# EAGLE schematic DAM1941 (EAGLE 9.3.1)

## Sheet 1 of 7
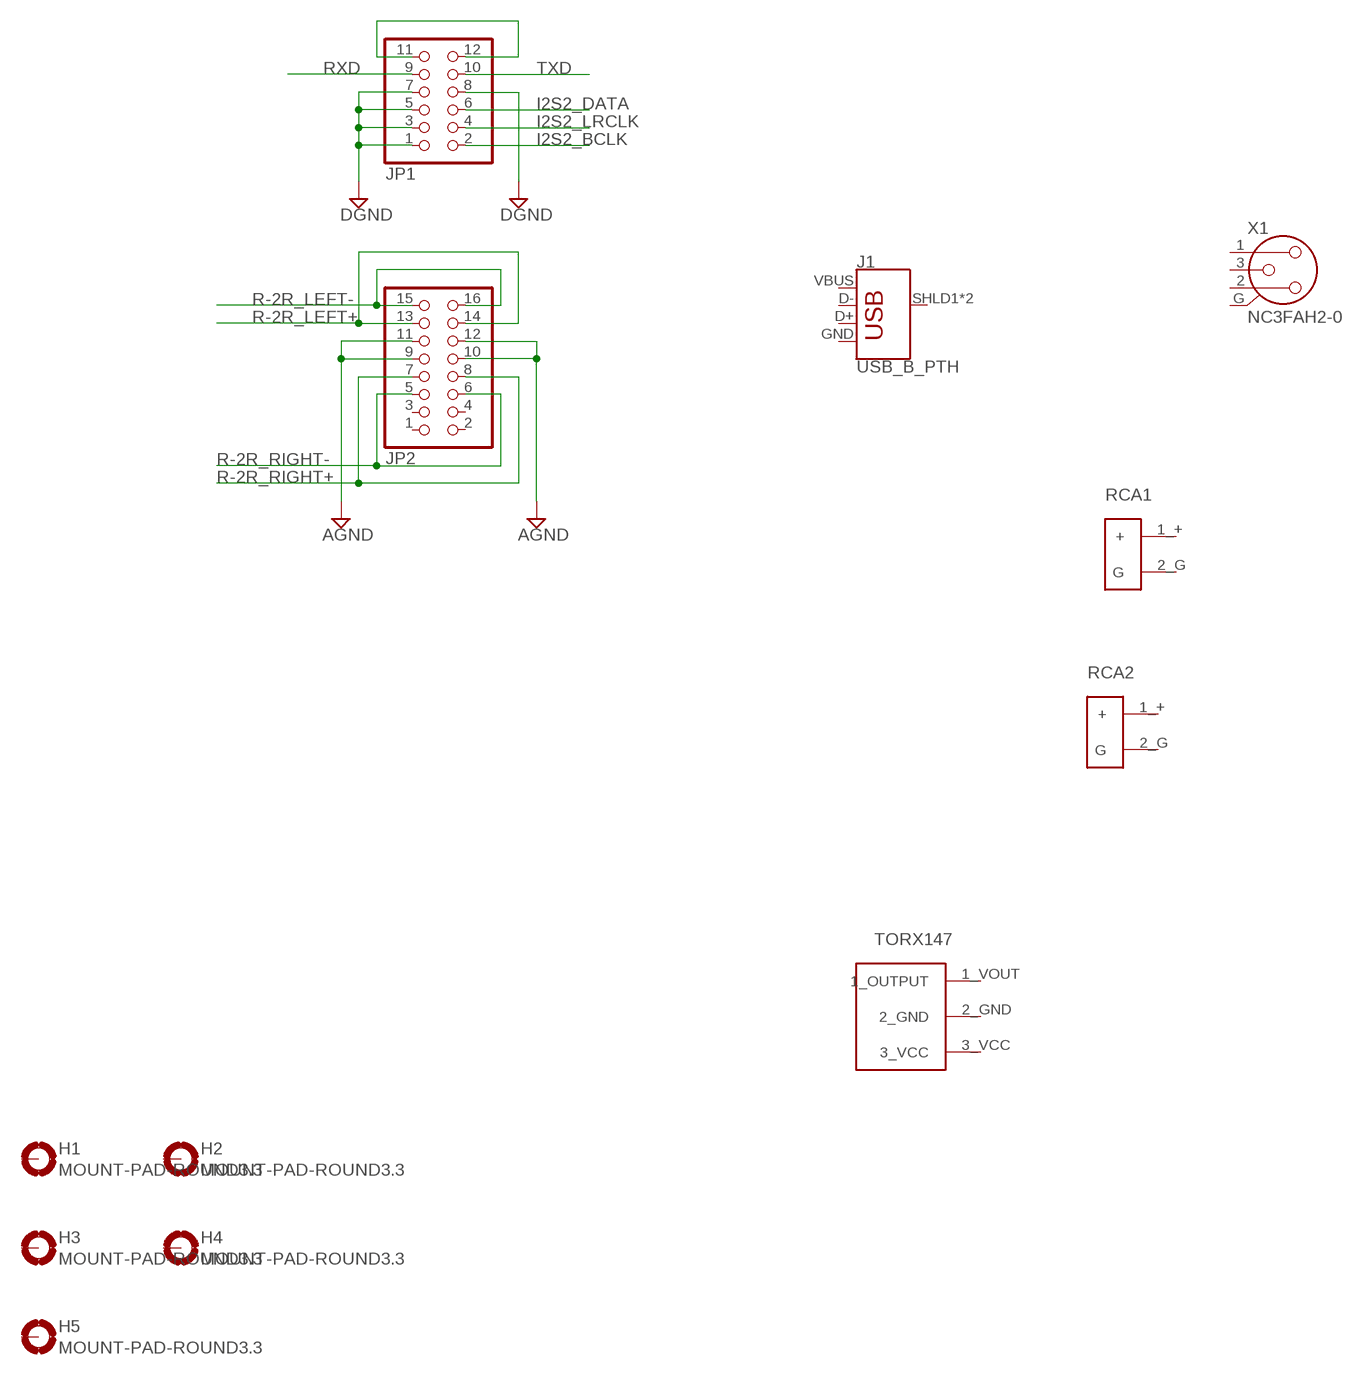
[diagram p0: schematic, sheet 1]

### Parts
H1  MOUNT-PAD-ROUND3.3  [3,3-PAD]
H2  MOUNT-PAD-ROUND3.3  [3,3-PAD]
H3  MOUNT-PAD-ROUND3.3  [3,3-PAD]
H4  MOUNT-PAD-ROUND3.3  [3,3-PAD]
H5  MOUNT-PAD-ROUND3.3  [3,3-PAD]
J1  USB_B_PTH  [USB-B-PTH]
JP1  PINHD-2X6/90  [2X06/90]
JP2  PINHD-2X8/90  [2X08/90]
RCA1  RCA  [RCA]
RCA2  RCA  [RCA]
U$1  TORX147  [TORX147]
X1  NC3FAH2-0  [NC3FAH2-0]

### Nets
AGND: JP2.9 JP2.10 JP2.11 JP2.12 ; also sheet 6
DGND: JP1.1 JP1.3 JP1.5 JP1.7 JP1.8 ; also sheet 3,5
I2S2_BCLK: JP1.2
I2S2_DATA: JP1.6
I2S2_LRCLK: JP1.4
N$1: JP1.11 JP1.12
R-2R_LEFT+: JP2.13 JP2.14 ; also sheet 2,3
R-2R_LEFT-: JP2.15 JP2.16 ; also sheet 2,3
R-2R_RIGHT+: JP2.7 JP2.8 ; also sheet 2,3
R-2R_RIGHT-: JP2.5 JP2.6 ; also sheet 2,3
RXD: JP1.9 ; also sheet 5
TXD: JP1.10 ; also sheet 5
Unconnected: H1.B3,3(MOUNT) H2.B3,3(MOUNT) H3.B3,3(MOUNT) H4.B3,3(MOUNT) H5.B3,3(MOUNT) J1.D+ J1.D- J1.SHLD1(SHIELD) J1.SHLD2(SHIELD) JP2.1 JP2.2 JP2.3 JP2.4 RCA1.1_+(+) RCA1.2_G(G) RCA2.1_+(+) RCA2.2_G(G) U$1.1_VOUT(1_OUTPUT) U$1.2_GND U$1.3_VCC X1.1 X1.2 X1.3 X1.G

## Sheet 2 of 7
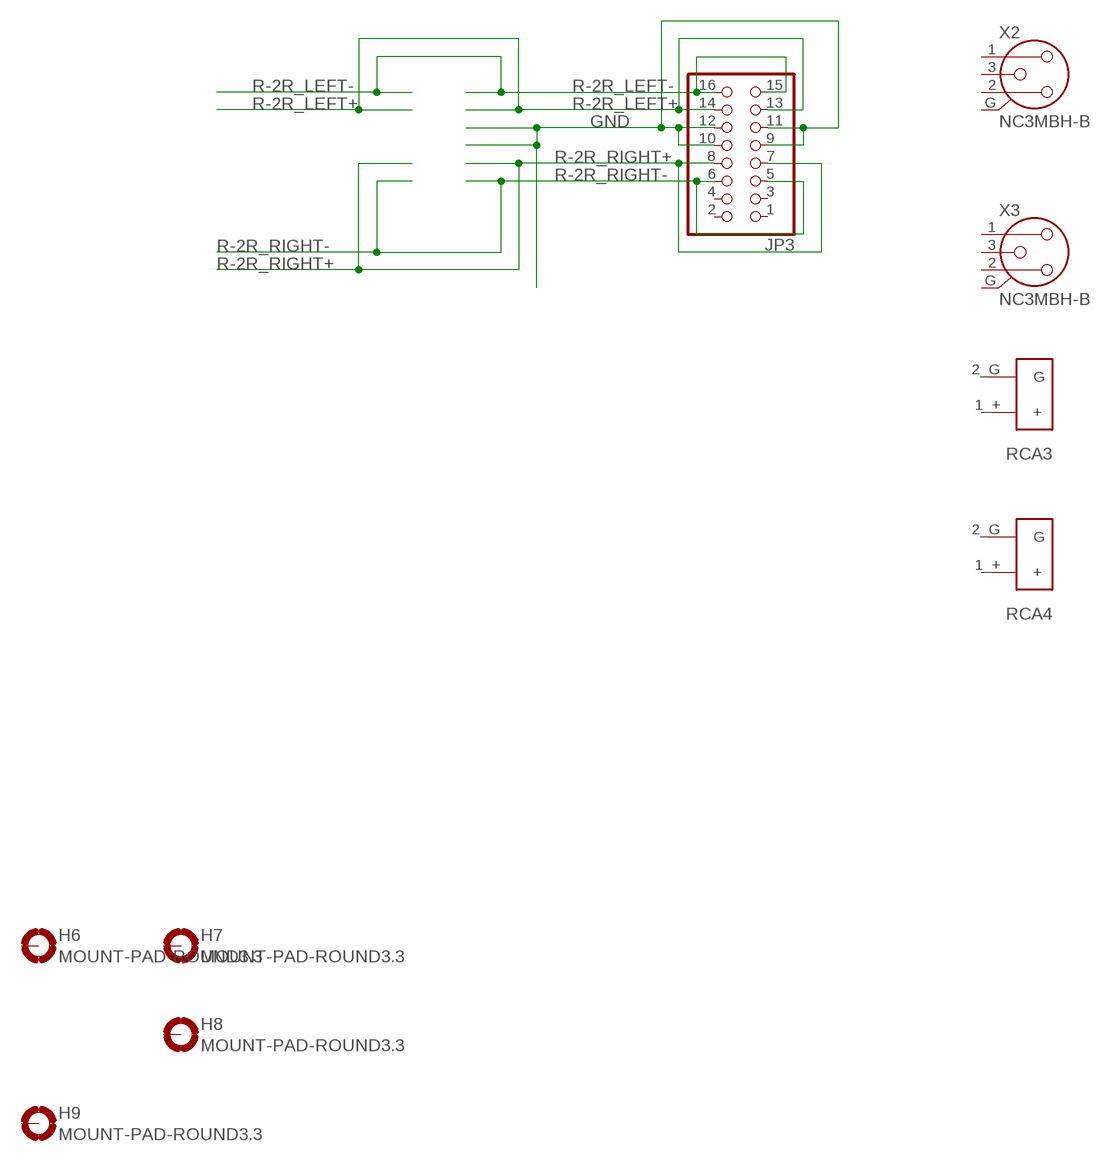
[diagram p1: schematic, sheet 2]

### Parts
H6  MOUNT-PAD-ROUND3.3  [3,3-PAD]
H7  MOUNT-PAD-ROUND3.3  [3,3-PAD]
H8  MOUNT-PAD-ROUND3.3  [3,3-PAD]
H9  MOUNT-PAD-ROUND3.3  [3,3-PAD]
JP3  PINHD-2X8  [2X08]
RCA3  RCA  [RCA]
RCA4  RCA  [RCA]
X2  NC3MBH-B  [NC3MBH-B]
X3  NC3MBH-B  [NC3MBH-B]

### Nets
GND: JP3.9 JP3.10 JP3.11 JP3.12 ; also sheet 3,4
R-2R_LEFT+: JP3.13 JP3.14 ; also sheet 1,3
R-2R_LEFT-: JP3.15 JP3.16 ; also sheet 1,3
R-2R_RIGHT+: JP3.7 JP3.8 ; also sheet 1,3
R-2R_RIGHT-: JP3.5 JP3.6 ; also sheet 1,3
Unconnected: H6.B3,3(MOUNT) H7.B3,3(MOUNT) H8.B3,3(MOUNT) H9.B3,3(MOUNT) JP3.1 JP3.2 JP3.3 JP3.4 RCA3.1_+(+) RCA3.2_G(G) RCA4.1_+(+) RCA4.2_G(G) X2.1 X2.2 X2.3 X2.G X3.1 X3.2 X3.3 X3.G

## Sheet 3 of 7
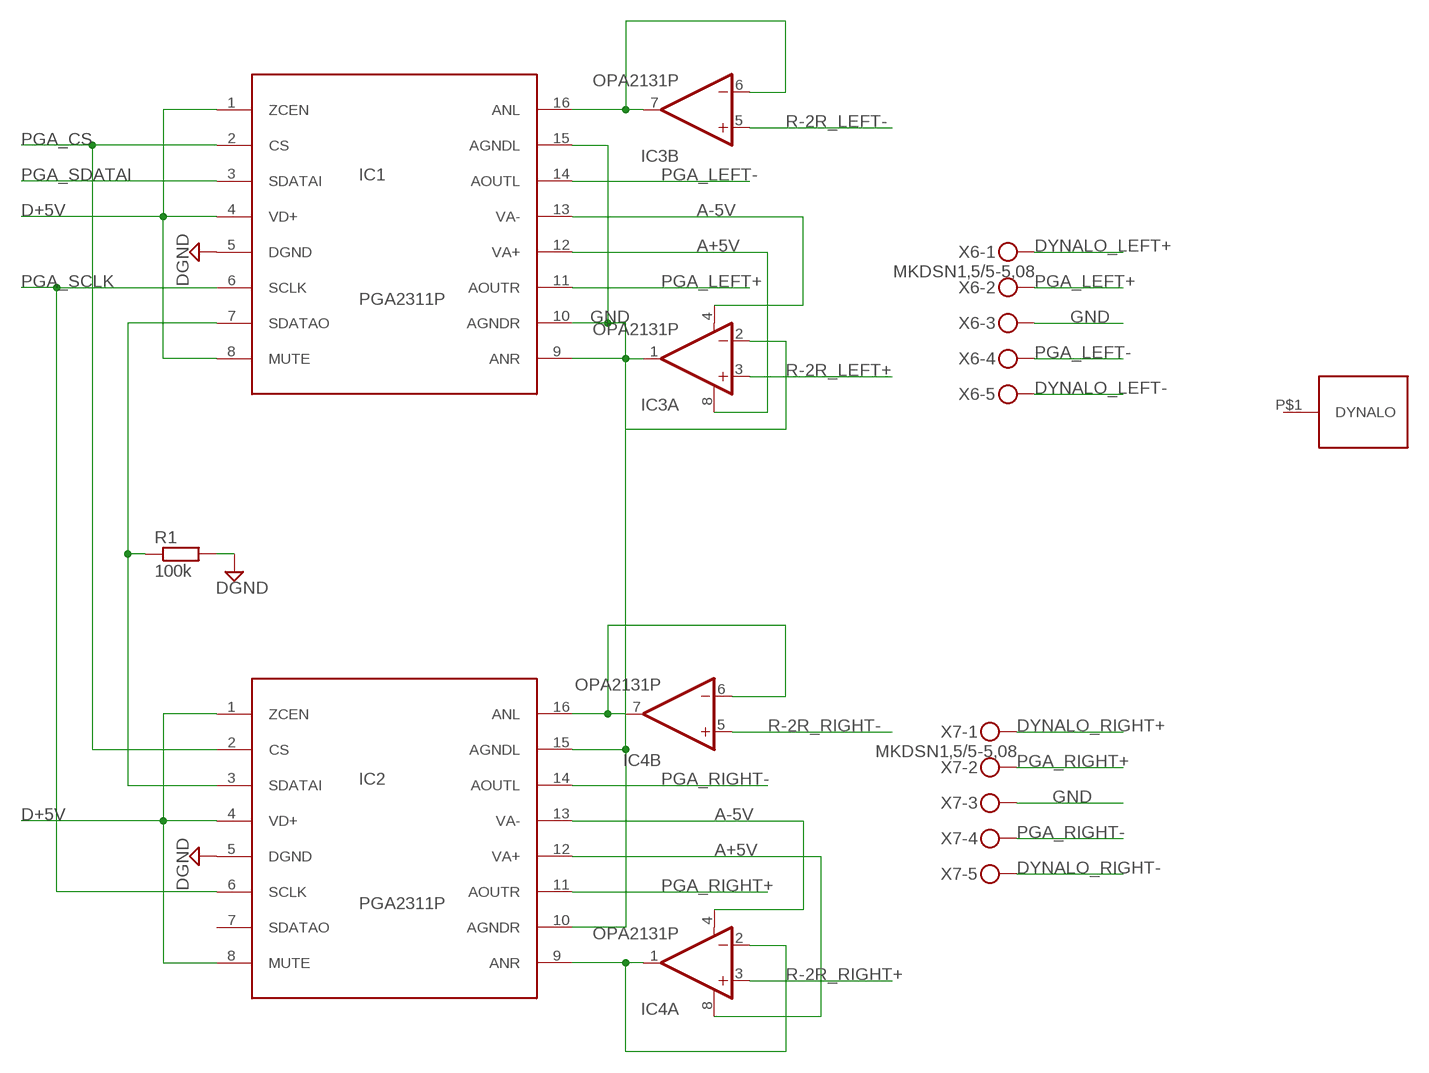
[diagram p2: schematic, sheet 3]

### Parts
IC1  PGA2311P  [DIL16]
IC2  PGA2311P  [DIL16]
IC3  OPA2131P  [DIL08]
IC4  OPA2131P  [DIL08]
R1  100k  R-EU_MELF0204R  [MINI_MELF-0204R]
U$3  DYNALO_DRILL  [DYNALO17_DRILL]
X6  MKDSN1,5/5-5,08  [MKDSN1,5/5-5,08]
X7  MKDSN1,5/5-5,08  [MKDSN1,5/5-5,08]

### Nets
A+5V: IC1.12(VA+) IC2.12(VA+) IC3.8(A:V+) IC4.8(A:V+) ; also sheet 4
A-5V: IC1.13(VA-) IC2.13(VA-) IC3.4(A:V-) IC4.4(A:V-) ; also sheet 4
D+5V: IC1.1(ZCEN) IC1.4(VD+) IC1.8(MUTE) IC2.1(ZCEN) IC2.4(VD+) IC2.8(MUTE)
DGND: IC1.5(DGND) IC2.5(DGND) R1.2 ; also sheet 1,5
DYNALO_LEFT+: X6.1 ; also sheet 4
DYNALO_LEFT-: X6.5 ; also sheet 4
DYNALO_RIGHT+: X7.1 ; also sheet 4
DYNALO_RIGHT-: X7.5 ; also sheet 4
GND: IC1.10(AGNDR) IC1.15(AGNDL) IC2.10(AGNDR) IC2.15(AGNDL) X6.3 X7.3 ; also sheet 2,4
N$2: IC2.9(ANR) IC4.1(A:OUT) IC4.2(A:-IN)
N$3: IC2.16(ANL) IC4.6(B:-IN) IC4.7(B:OUT)
N$4: IC1.9(ANR) IC3.1(A:OUT) IC3.2(A:-IN)
N$5: IC1.16(ANL) IC3.6(B:-IN) IC3.7(B:OUT)
N$7: IC1.7(SDATAO) IC2.3(SDATAI) R1.1
PGA_CS: IC1.2(CS) IC2.2(CS)
PGA_LEFT+: IC1.11(AOUTR) X6.2
PGA_LEFT-: IC1.14(AOUTL) X6.4
PGA_RIGHT+: IC2.11(AOUTR) X7.2
PGA_RIGHT-: IC2.14(AOUTL) X7.4
PGA_SCLK: IC1.6(SCLK) IC2.6(SCLK)
PGA_SDATAI: IC1.3(SDATAI)
R-2R_LEFT+: IC3.3(A:+IN) ; also sheet 1,2
R-2R_LEFT-: IC3.5(B:+IN) ; also sheet 1,2
R-2R_RIGHT+: IC4.3(A:+IN) ; also sheet 1,2
R-2R_RIGHT-: IC4.5(B:+IN) ; also sheet 1,2
Unconnected: IC2.7(SDATAO) U$3.P$1(DYNALO)

## Sheet 4 of 7
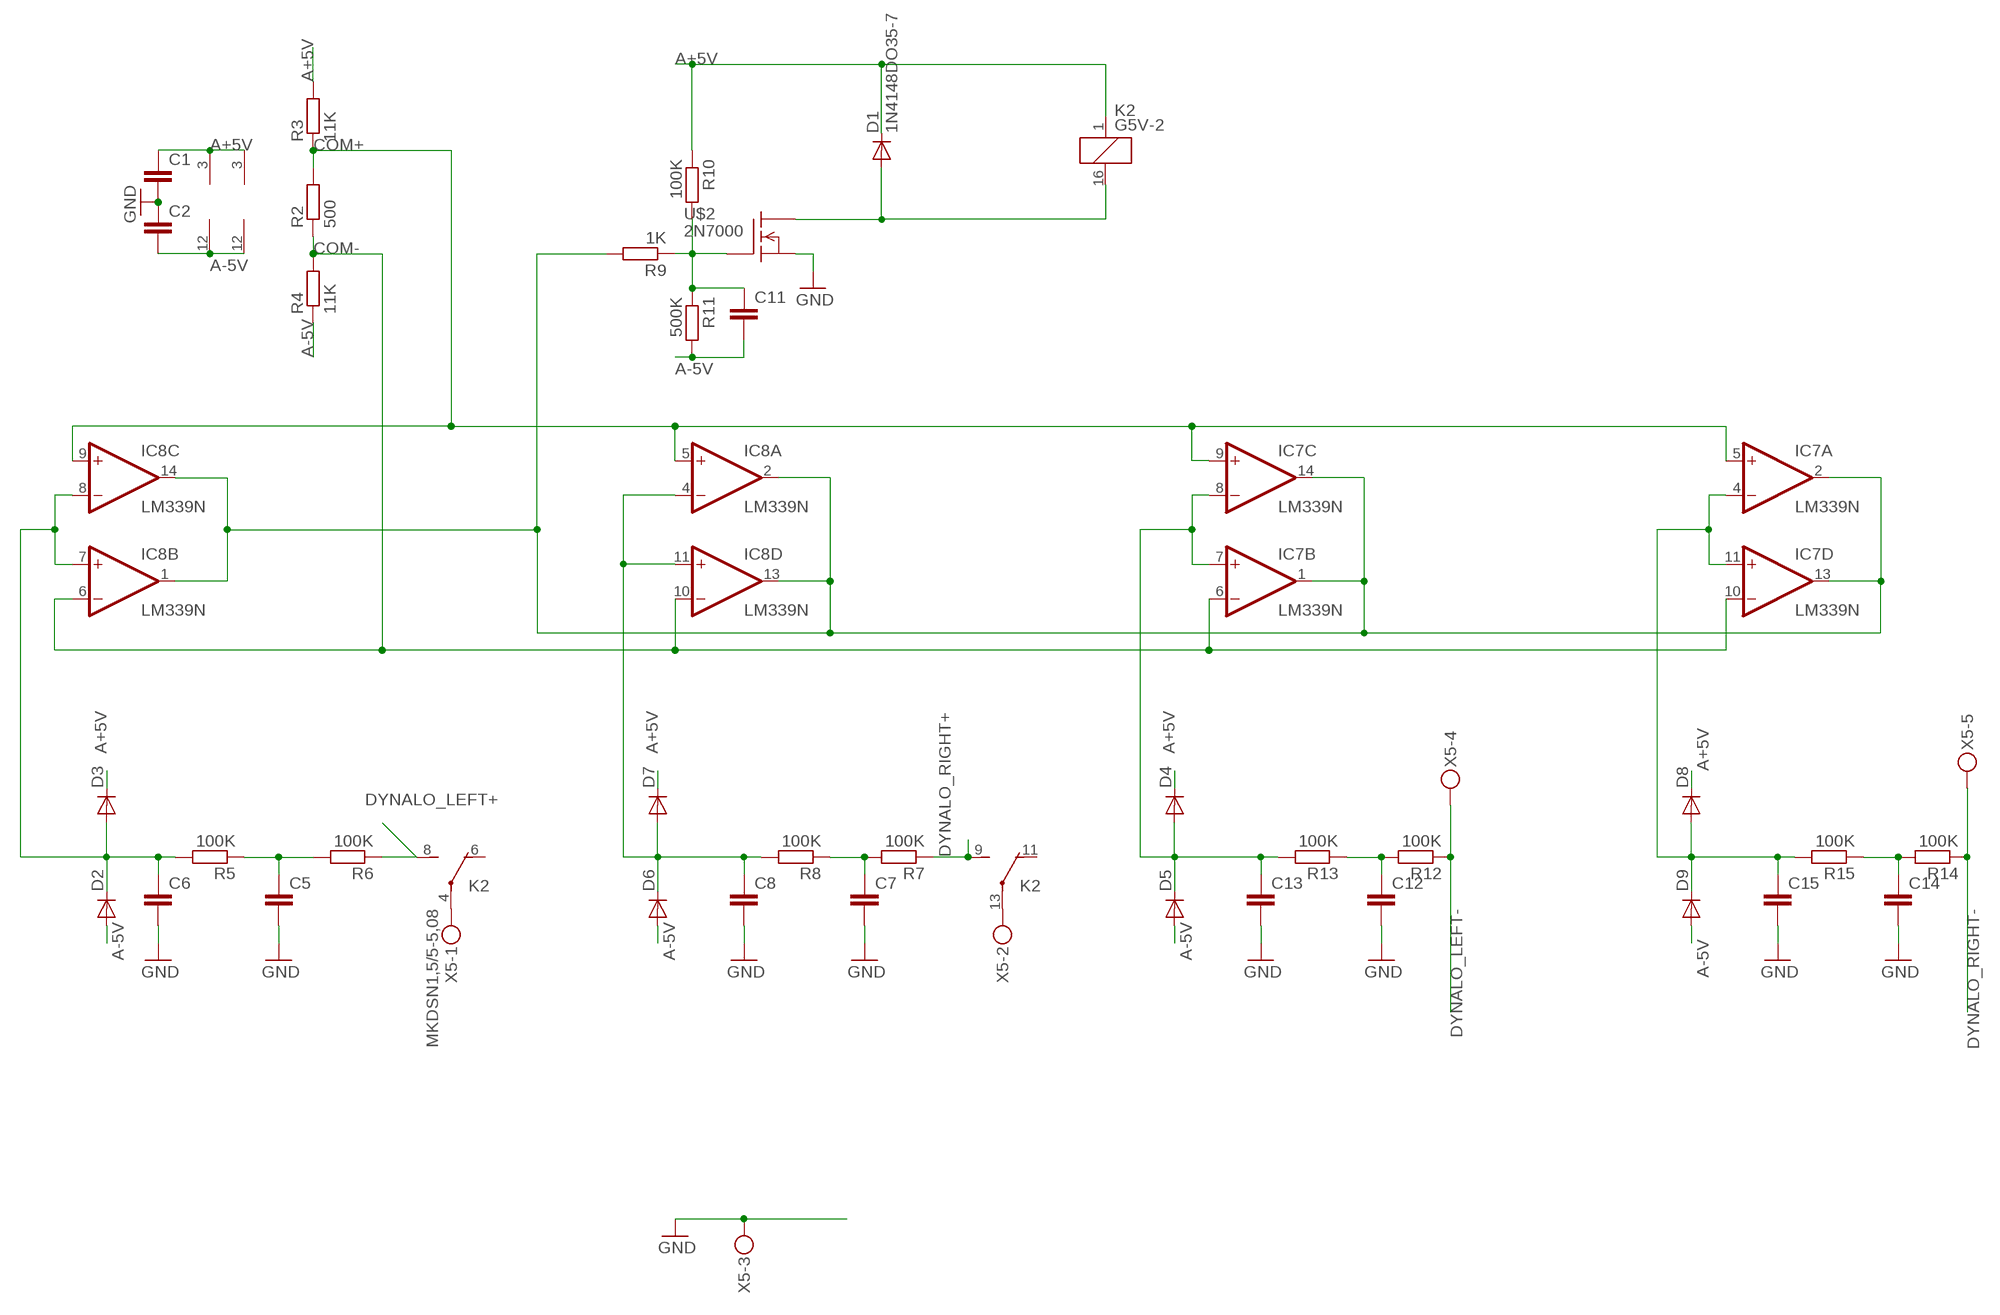
[diagram p3: schematic, sheet 4]

### Parts
C1  C-EU050-024X044  [C050-024X044]
C2  C-EU050-024X044  [C050-024X044]
C5  C-EU050-024X044  [C050-024X044]
C6  C-EU050-024X044  [C050-024X044]
C7  C-EU050-024X044  [C050-024X044]
C8  C-EU050-024X044  [C050-024X044]
C11  C-EU050-024X044  [C050-024X044]
C12  C-EU050-024X044  [C050-024X044]
C13  C-EU050-024X044  [C050-024X044]
C14  C-EU050-024X044  [C050-024X044]
C15  C-EU050-024X044  [C050-024X044]
D1  1N4148DO35-7  [DO35-7]
D2  DIODE-D-5  [D-5]
D3  DIODE-D-5  [D-5]
D4  DIODE-D-5  [D-5]
D5  DIODE-D-5  [D-5]
D6  DIODE-D-5  [D-5]
D7  DIODE-D-5  [D-5]
D8  DIODE-D-5  [D-5]
D9  DIODE-D-5  [D-5]
IC7  LM339N  [DIL14]
IC8  LM339N  [DIL14]
K2  G5V-2  [G5V-2]
R2  500  R-EU_0207/12  [0207/12]
R3  11K  R-EU_0207/12  [0207/12]
R4  11K  R-EU_0207/12  [0207/12]
R5  100K  R-EU_0207/5V  [0207/5V]
R6  100K  R-EU_0207/10  [0207/10]
R7  100K  R-EU_0207/5V  [0207/5V]
R8  100K  R-EU_0207/5V  [0207/5V]
R9  1K  R-EU_0207/12  [0207/12]
R10  100K  R-EU_0207/12  [0207/12]
R11  500K  R-EU_0207/12  [0207/12]
R12  100K  R-EU_0207/5V  [0207/5V]
R13  100K  R-EU_0207/5V  [0207/5V]
R14  100K  R-EU_0207/5V  [0207/5V]
R15  100K  R-EU_0207/5V  [0207/5V]
U$2  2N7000  [TO92-]
X5  MKDSN1,5/5-5,08  [MKDSN1,5/5-5,08]

### Nets
A+5V: C1.1 D1.C D3.C D4.C D7.C D8.C IC7.3(P:V+) IC8.3(P:V+) K2.1 R3.2 R10.1 ; also sheet 3
A-5V: C2.2 C11.2 D2.A D5.A D6.A D9.A IC7.12(P:GND) IC8.12(P:GND) R4.1 R11.2 ; also sheet 3
COM+: IC7.5(A:+IN) IC7.9(C:+IN) IC8.5(A:+IN) IC8.9(C:+IN) R2.2 R3.1
COM-: IC7.6(B:-IN) IC7.10(D:-IN) IC8.6(B:-IN) IC8.10(D:-IN) R2.1 R4.2
DYNALO_LEFT+: K2.8(1:S) R6.1 ; also sheet 3
DYNALO_LEFT-: R12.1 X5.4 ; also sheet 3
DYNALO_RIGHT+: K2.9(2:S) R7.1 ; also sheet 3
DYNALO_RIGHT-: R14.1 X5.5 ; also sheet 3
GND: C1.2 C2.1 C5.2 C6.2 C7.2 C8.2 C12.2 C13.2 C14.2 C15.2 U$2.3(S) X5.3 ; also sheet 2,3
N$9: C5.1 R5.1 R6.2
N$10: C7.1 R7.2 R8.1
N$11: C11.1 R9.1 R10.2 R11.1 U$2.2(G)
N$12: C6.1 D2.C D3.A IC8.7(B:+IN) IC8.8(C:-IN) R5.2
N$13: C8.1 D6.C D7.A IC8.4(A:-IN) IC8.11(D:+IN) R8.2
N$14: D1.A K2.16 U$2.1(D)
N$15: C13.1 D4.A D5.C IC7.7(B:+IN) IC7.8(C:-IN) R13.2
N$16: C15.1 D8.A D9.C IC7.4(A:-IN) IC7.11(D:+IN) R15.2
N$17: IC7.1(B:OUT) IC7.2(A:OUT) IC7.13(D:OUT) IC7.14(C:OUT) IC8.1(B:OUT) IC8.2(A:OUT) IC8.13(D:OUT) IC8.14(C:OUT) R9.2
N$19: C12.1 R12.2 R13.1
N$21: C14.1 R14.2 R15.1
N$22: K2.13(2:P) X5.2
N$23: K2.4(1:P) X5.1
Unconnected: K2.6(1:O) K2.11(2:O)

## Sheet 5 of 7
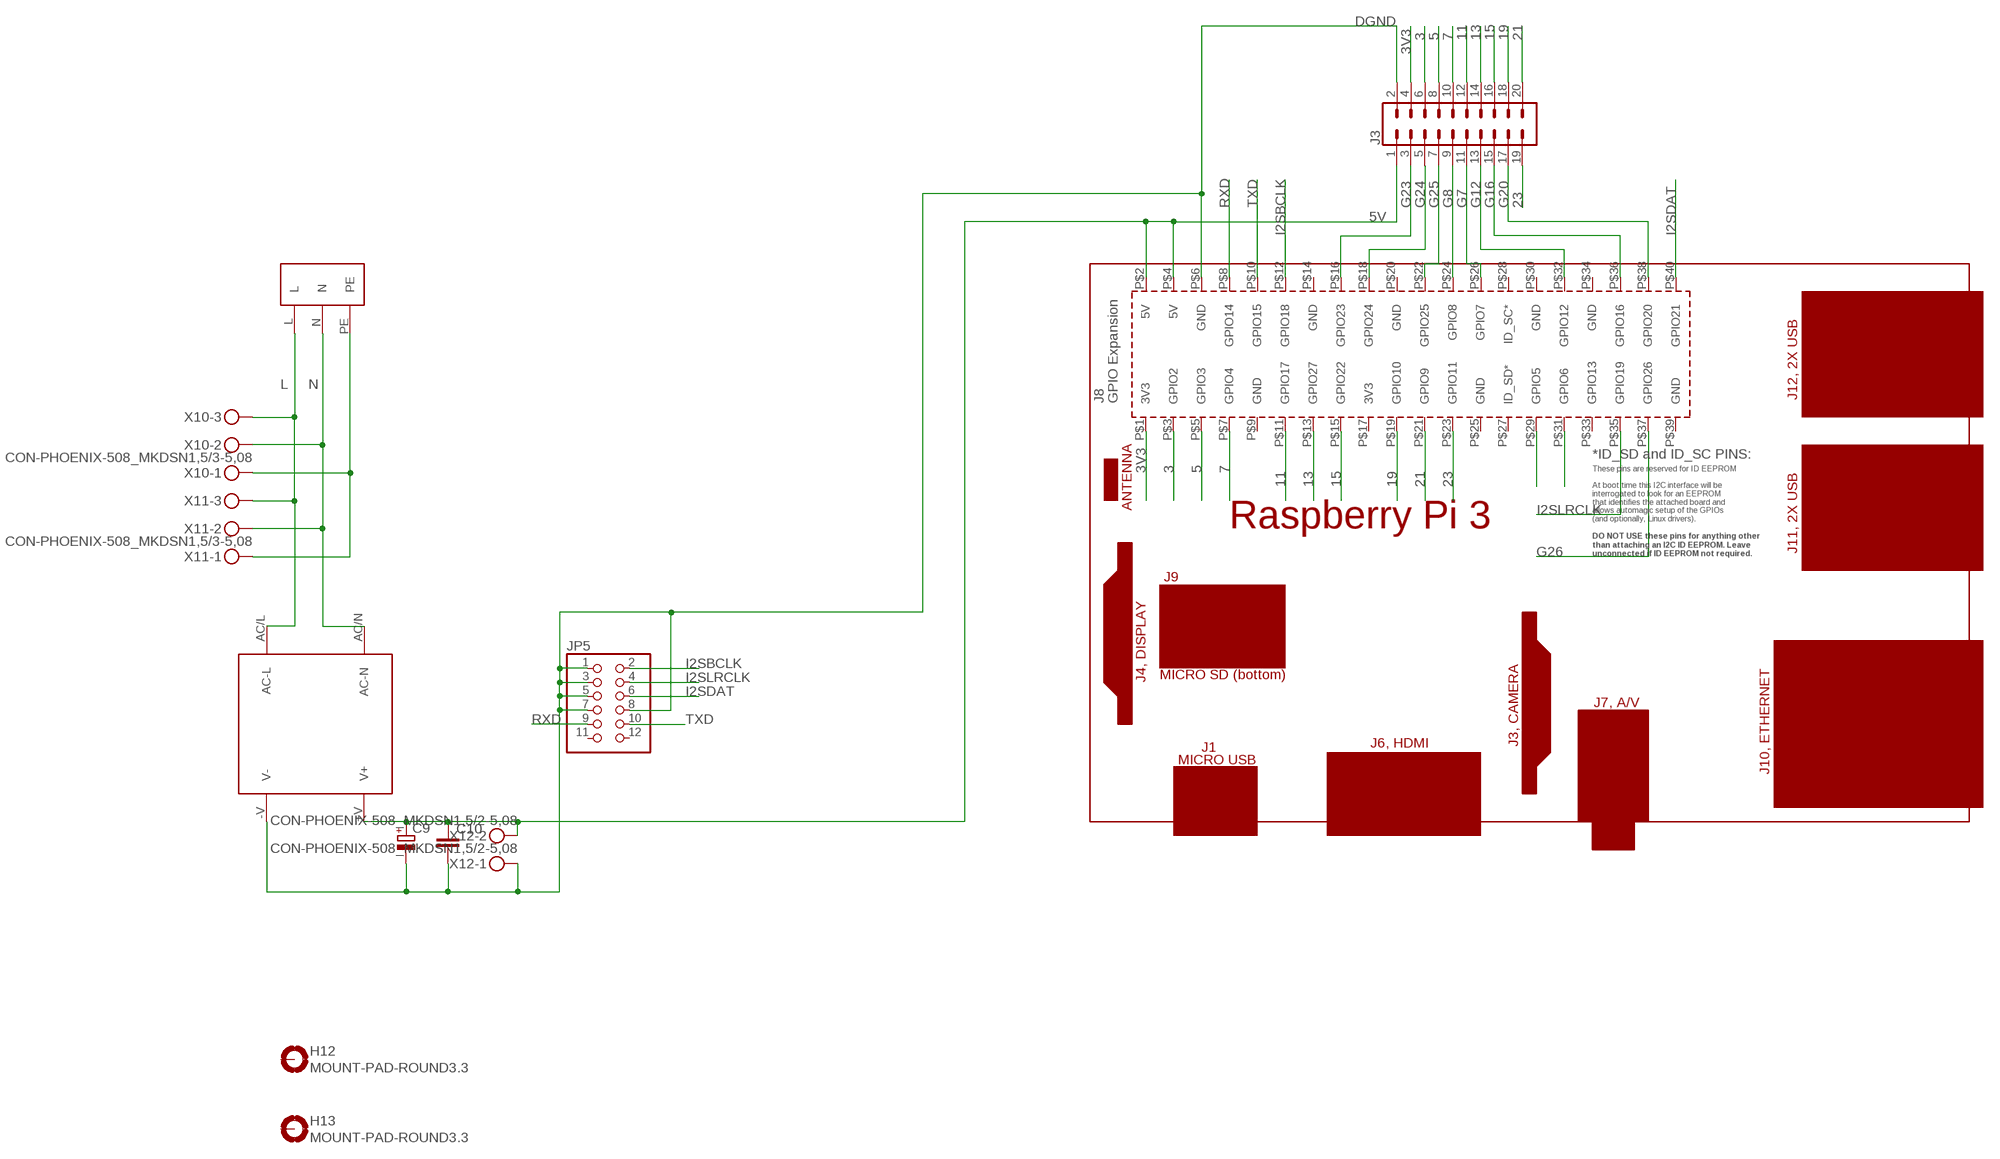
[diagram p4: schematic, sheet 5]

### Parts
C9  CPOL-EUE5-8.5  [E5-8,5]
C10  C-EU050-050X075  [C050-050X075]
H12  MOUNT-PAD-ROUND3.3  [3,3-PAD]
H13  MOUNT-PAD-ROUND3.3  [3,3-PAD]
J3  CONN_10X22X10_LOCK  [2X10_LOCK]
JP5  PINHD-2X6  [2X06]
PCB2  RPI3  [RPI3]
U$5  DD21  [DD21.NOCOVER]
U$7  IRM-15-5  [IRM-15]
X10  CON-PHOENIX-508_MKDSN1,5/3-5,08  [CON-PHOENIX-508_MKDSN1,5/3-5,08]
X11  CON-PHOENIX-508_MKDSN1,5/3-5,08  [CON-PHOENIX-508_MKDSN1,5/3-5,08]
X12  CON-PHOENIX-508_MKDSN1,5/2-5,08  [CON-PHOENIX-508_MKDSN1,5/2-5,08]

### Nets
3: J3.6 PCB2.P$3(GPIO2)
3V3: J3.4 PCB2.P$1(3V3)
5: J3.8 PCB2.P$5(GPIO3)
5V: C9.+ C10.1 J3.1 PCB2.P$2(5V) PCB2.P$4(5V) U$7.+V(V+) X12.2
7: J3.10 PCB2.P$7(GPIO4)
11: J3.12 PCB2.P$11(GPIO17)
13: J3.14 PCB2.P$13(GPIO27)
15: J3.16 PCB2.P$15(GPIO22)
19: J3.18 PCB2.P$19(GPIO10)
21: J3.20 PCB2.P$21(GPIO9)
23: J3.19 PCB2.P$23(GPIO11)
DGND: C9.- C10.2 J3.2 JP5.1 JP5.3 JP5.5 JP5.7 JP5.8 PCB2.P$6(GND) U$7.-V(V-) X12.1 ; also sheet 1,3
G7: J3.11 PCB2.P$26(GPIO7)
G8: J3.9 PCB2.P$24(GPIO8)
G12: J3.13 PCB2.P$32(GPIO12)
G16: J3.15 PCB2.P$36(GPIO16)
G20: J3.17 PCB2.P$38(GPIO20)
G23: J3.3 PCB2.P$16(GPIO23)
G24: J3.5 PCB2.P$18(GPIO24)
G25: J3.7 PCB2.P$22(GPIO25)
G26: PCB2.P$37(GPIO26)
I2SBCLK: JP5.2 PCB2.P$12(GPIO18)
I2SDAT: JP5.6 PCB2.P$40(GPIO21)
I2SLRCLK: JP5.4 PCB2.P$35(GPIO19)
L: U$5.L U$7.AC/L(AC-L) X10.3 X11.3
N: U$5.N U$7.AC/N(AC-N) X10.2 X11.2
N$20: U$5.PE X10.1 X11.1
N$24: PCB2.P$29(GPIO5)
N$25: PCB2.P$31(GPIO6)
RXD: JP5.9 PCB2.P$8(GPIO14) ; also sheet 1
TXD: JP5.10 PCB2.P$10(GPIO15) ; also sheet 1
Unconnected: H12.B3,3(MOUNT) H13.B3,3(MOUNT) JP5.11 JP5.12 PCB2.P$9(GND) PCB2.P$14(GND) PCB2.P$17(3V3) PCB2.P$20(GND) PCB2.P$25(GND) PCB2.P$27(ID_SD*) PCB2.P$28(ID_SC*) PCB2.P$30(GND) PCB2.P$33(GPIO13) PCB2.P$34(GND) PCB2.P$39(GND)

## Sheet 6 of 7
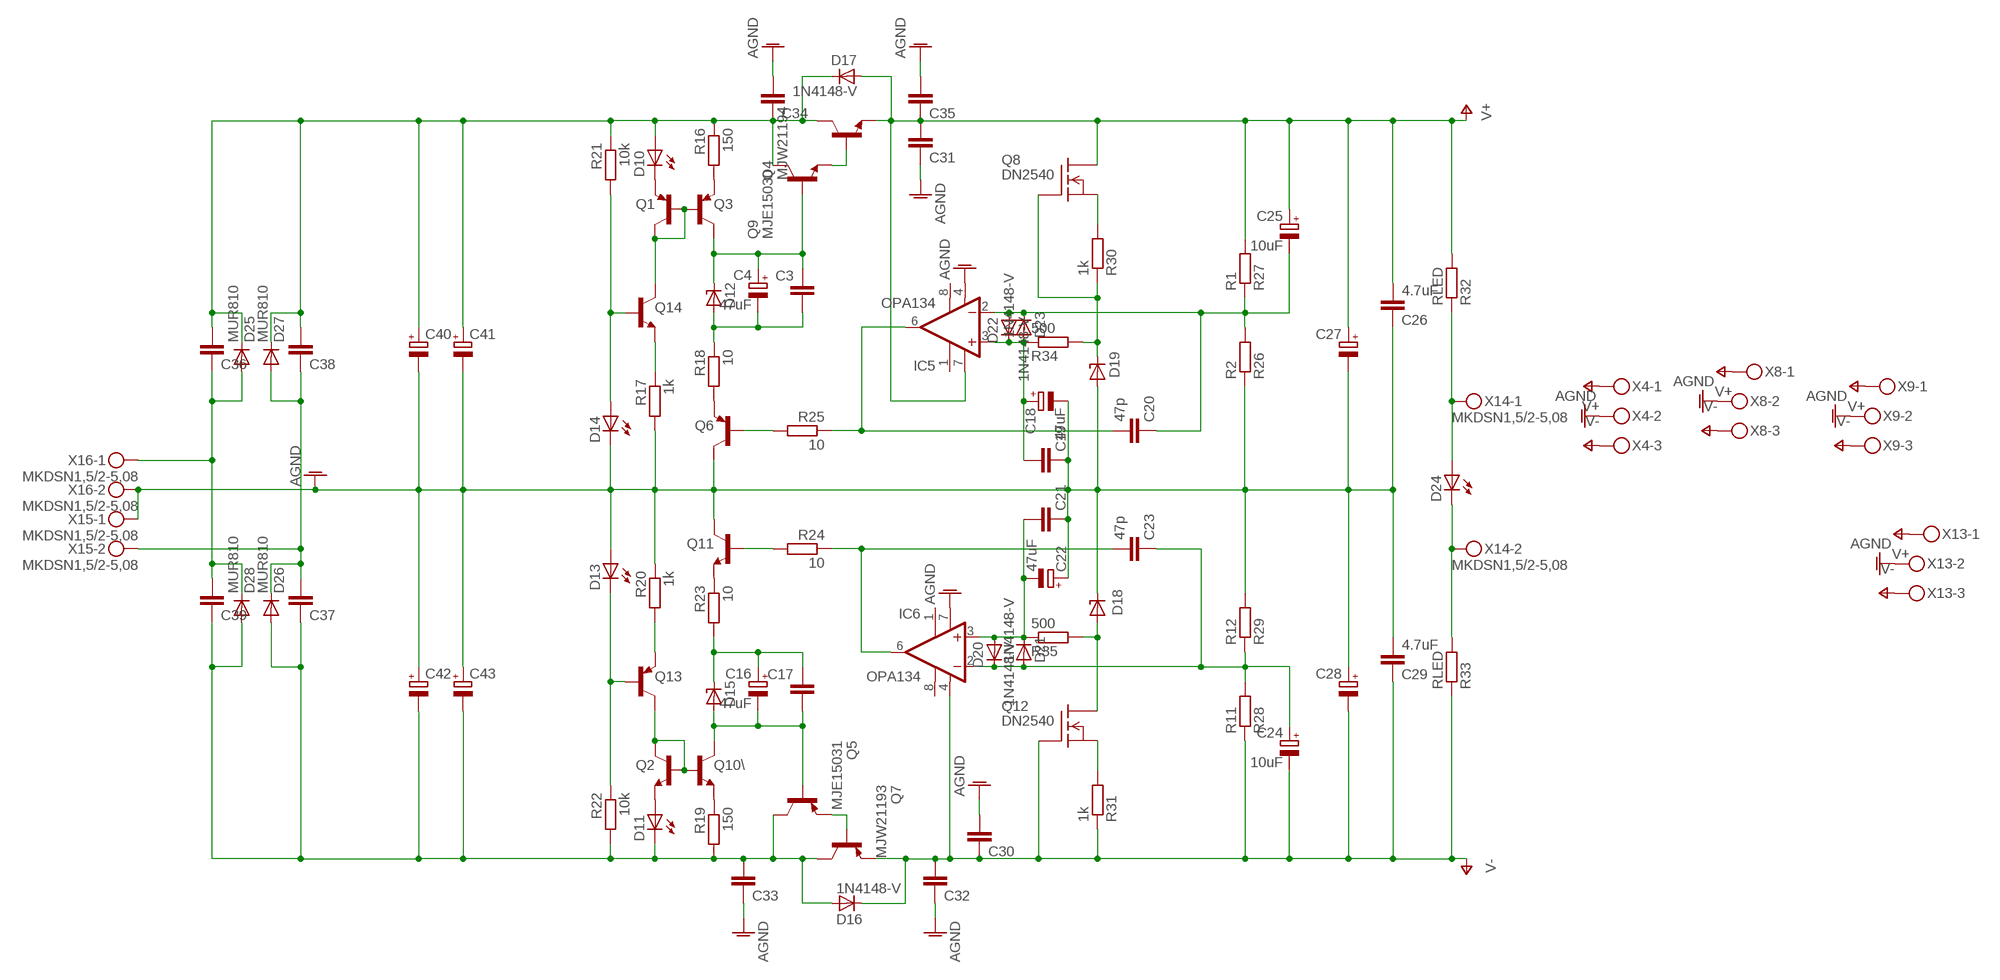
[diagram p5: schematic, sheet 6]

### Parts
C3  C-EU050-035X075  [C050-035X075]
C4  47uF  CPOL-EUE5-8.5  [E5-8,5]
C16  47uF  CPOL-EUE5-8.5  [E5-8,5]
C17  C-EU050-035X075  [C050-035X075]
C18  47uF  CPOL-EUE5-8.5  [E5-8,5]
C19  C-EU050-035X075  [C050-035X075]
C20  47p  C-EU025_050-025X075  [C025_050-025X075]
C21  C-EU050-035X075  [C050-035X075]
C22  47uF  CPOL-EUE5-8.5  [E5-8,5]
C23  47p  C-EU025_050-025X075  [C025_050-025X075]
C24  10uF  CPOL-EUE5-8.5  [E5-8,5]
C25  10uF  CPOL-EUE5-8.5  [E5-8,5]
C26  4.7uF  C-EU050-075X075  [C050-075X075]
C27  CPOL-EUE7.5-18  [E7,5-18]
C28  CPOL-EUE7.5-18  [E7,5-18]
C29  4.7uF  C-EU050-075X075  [C050-075X075]
C30  C-EU050-035X075  [C050-035X075]
C31  C-EU050-035X075  [C050-035X075]
C32  C-EU050-035X075  [C050-035X075]
C33  C-EU050-075X075  [C050-075X075]
C34  C-EU050-075X075  [C050-075X075]
C35  C-EU050-035X075  [C050-035X075]
C36  C-EU050-035X075  [C050-035X075]
C37  C-EU050-035X075  [C050-035X075]
C38  C-EU050-035X075  [C050-035X075]
C39  C-EU050-035X075  [C050-035X075]
C40  CPOL-EUE7.5-18  [E7,5-18]
C41  CPOL-EUE7.5-18  [E7,5-18]
C42  CPOL-EUE7.5-18  [E7,5-18]
C43  CPOL-EUE7.5-18  [E7,5-18]
D10  LED5MM  [LED5MM]
D11  LED5MM  [LED5MM]
D12  1N4728  [DO41Z10]
D13  LED5MM  [LED5MM]
D14  LED5MM  [LED5MM]
D15  1N4728  [DO41Z10]
D16  1N4148-V  [1N4148]
D17  1N4148-V  [1N4148]
D18  LT1021  LT1021-V  [DIL08]
D19  LT1021  LT1021-V  [DIL08]
D20  1N4148-V  [1N4148]
D21  1N4148-V  [1N4148]
D22  1N4148-V  [1N4148]
D23  1N4148-V  [1N4148]
D24  LED5MM  [LED5MM]
D25  MUR810  [TO220ACS]
D26  MUR810  [TO220ACS]
D27  MUR810  [TO220ACS]
D28  MUR810  [TO220ACS]
IC5  OPA134  OPA134P  [DIL08]
IC6  OPA134  OPA134P  [DIL08]
Q1  MPSA92-PNP-TO92-EBC  [TO92-EBC]
Q2  MPSA42-NPN-TO92-EBC  [TO92-EBC]
Q3  MPSA92-PNP-TO92-EBC  [TO92-EBC]
Q4  MJW21194  MJL4281  [TO-264]
Q5  MJE15031  [TO220KG]
Q6  MPSA92-PNP-TO92-EBC  [TO92-EBC]
Q7  MJW21193  MJL4302  [TO-264]
Q8  DN2540  2N7000  [TO92-]
Q9  MJE15030  [TO220KG]
Q10\  MPSA42-NPN-TO92-EBC  [TO92-EBC]
Q11  MPSA42-NPN-TO92-EBC  [TO92-EBC]
Q12  DN2540  2N7000  [TO92-]
Q13  MPSA92-PNP-TO92-EBC  [TO92-EBC]
Q14  MPSA42-NPN-TO92-EBC  [TO92-EBC]
R16  150  R-EU_0309/12  [0309/12]
R17  1k  R-EU_0309/12  [0309/12]
R18  10  R-EU_0309/12  [0309/12]
R19  150  R-EU_0309/12  [0309/12]
R20  1k  R-EU_0309/12  [0309/12]
R21  10k  R-EU_0309/12  [0309/12]
R22  10k  R-EU_0309/12  [0309/12]
R23  10  R-EU_0309/12  [0309/12]
R24  10  R-EU_0309/12  [0309/12]
R25  10  R-EU_0309/12  [0309/12]
R26  R2  R-EU_0309/12  [0309/12]
R27  R1  R-EU_0309/12  [0309/12]
R28  R11  R-EU_0309/12  [0309/12]
R29  R12  R-EU_0309/12  [0309/12]
R30  1k  R-EU_0309/12  [0309/12]
R31  1k  R-EU_0309/12  [0309/12]
R32  RLED  R-EU_0309/12  [0309/12]
R33  RLED  R-EU_0309/12  [0309/12]
R34  500  R-EU_0309/12  [0309/12]
R35  500  R-EU_0309/12  [0309/12]
X4  MKDSN1,5/3-5,08  [MKDSN1,5/3-5,08]
X8  MKDSN1,5/3-5,08  [MKDSN1,5/3-5,08]
X9  MKDSN1,5/3-5,08  [MKDSN1,5/3-5,08]
X13  MKDSN1,5/3-5,08  [MKDSN1,5/3-5,08]
X14  MKDSN1,5/2-5,08  [MKDSN1,5/2-5,08]
X15  MKDSN1,5/2-5,08  [MKDSN1,5/2-5,08]
X16  MKDSN1,5/2-5,08  [MKDSN1,5/2-5,08]

### Nets
AGND: C18.- C19.1 C21.1 C22.+ C26.1 C27.- C28.+ C29.2 C30.2 C31.1 C32.1 C33.1 C34.2 C35.2 C40.- C41.- C42.+ C43.+ D13.A D14.K(C) D18.6(OUT) D19.4(GND) IC5.4(V-) IC6.7(V+) Q6.C Q11.C R17.2 R20.1 R26.1 R29.2 X4.2 X8.2 X9.2 X13.2 X15.1 X16.2 ; also sheet 1
N$6: Q1.B Q1.C Q3.B Q14.C
N$8: D10.K(C) Q1.E
N$18: Q3.E R16.2
N$26: C34.1 C36.2 C38.2 C40.+ C41.+ D10.A D17.C D25.C D27.C Q4.C Q9.2(C) R16.1 R21.1
N$27: C3.1 C4.+ D12.C Q3.C Q9.1(B)
N$28: C3.2 C4.- D12.A R18.1
N$29: Q6.E R18.2
N$30: Q14.E R17.1
N$31: D14.A Q14.B R21.2
N$32: Q13.E R20.2
N$33: D13.K(C) Q13.B R22.1
N$34: Q11.E R23.1
N$35: C16.+ C17.1 D15.C R23.2
N$36: C16.- C17.2 D15.A Q5.1(B) Q10\.C
N$37: Q2.B Q2.C Q10\.B Q13.C
N$38: Q10\.E R19.1
N$39: D11.A Q2.E
N$40: Q5.3(E) Q7.B
N$41: Q4.B Q9.3(E)
N$42: C20.2 C20.3 IC5.6(OUT) R25.1
N$43: C23.2 C23.3 IC6.6(OUT) R24.1
N$44: Q11.B R24.2
N$45: Q6.B R25.2
N$46: C20.1 C25.- D22.A D23.C IC5.2(-IN) R26.2 R27.1
N$47: D19.6(OUT) Q8.2(G) R30.1 R34.2
N$48: C18.+ C19.2 D22.C D23.A IC5.3(+IN) R34.1
N$49: C21.2 C22.- D20.A D21.C IC6.3(+IN) R35.1
N$50: D18.4(GND) Q12.1(D) R35.2
N$51: C23.1 C24.+ D20.C D21.A IC6.2(-IN) R28.2 R29.1
N$52: Q12.3(S) R31.2
N$53: Q8.3(S) R30.2
N$54: D24.K(C) R33.2 X14.2
N$55: D24.A R32.1 X14.1
N$56: C33.2 C37.1 C39.1 C42.- C43.- D11.K(C) D16.A D26.A D28.A Q5.2(C) Q7.C R19.2 R22.2
N$57: C36.1 C39.2 D25.A D28.C X16.1
N$58: C37.2 C38.1 D26.C D27.A X15.2
V+: C25.+ C26.2 C27.+ C31.2 C35.1 D17.A IC5.7(V+) Q4.E Q8.1(D) R27.2 R32.2 X4.1 X8.1 X9.1 X13.1
V-: C24.- C28.- C29.1 C30.1 C32.2 D16.C IC6.4(V-) Q7.E Q12.2(G) R28.1 R31.1 R33.1 X4.3 X8.3 X9.3 X13.3
Unconnected: IC5.1(TRIM1) IC5.8(TRIM2) IC6.1(TRIM1) IC6.8(TRIM2)

## Sheet 7 of 7
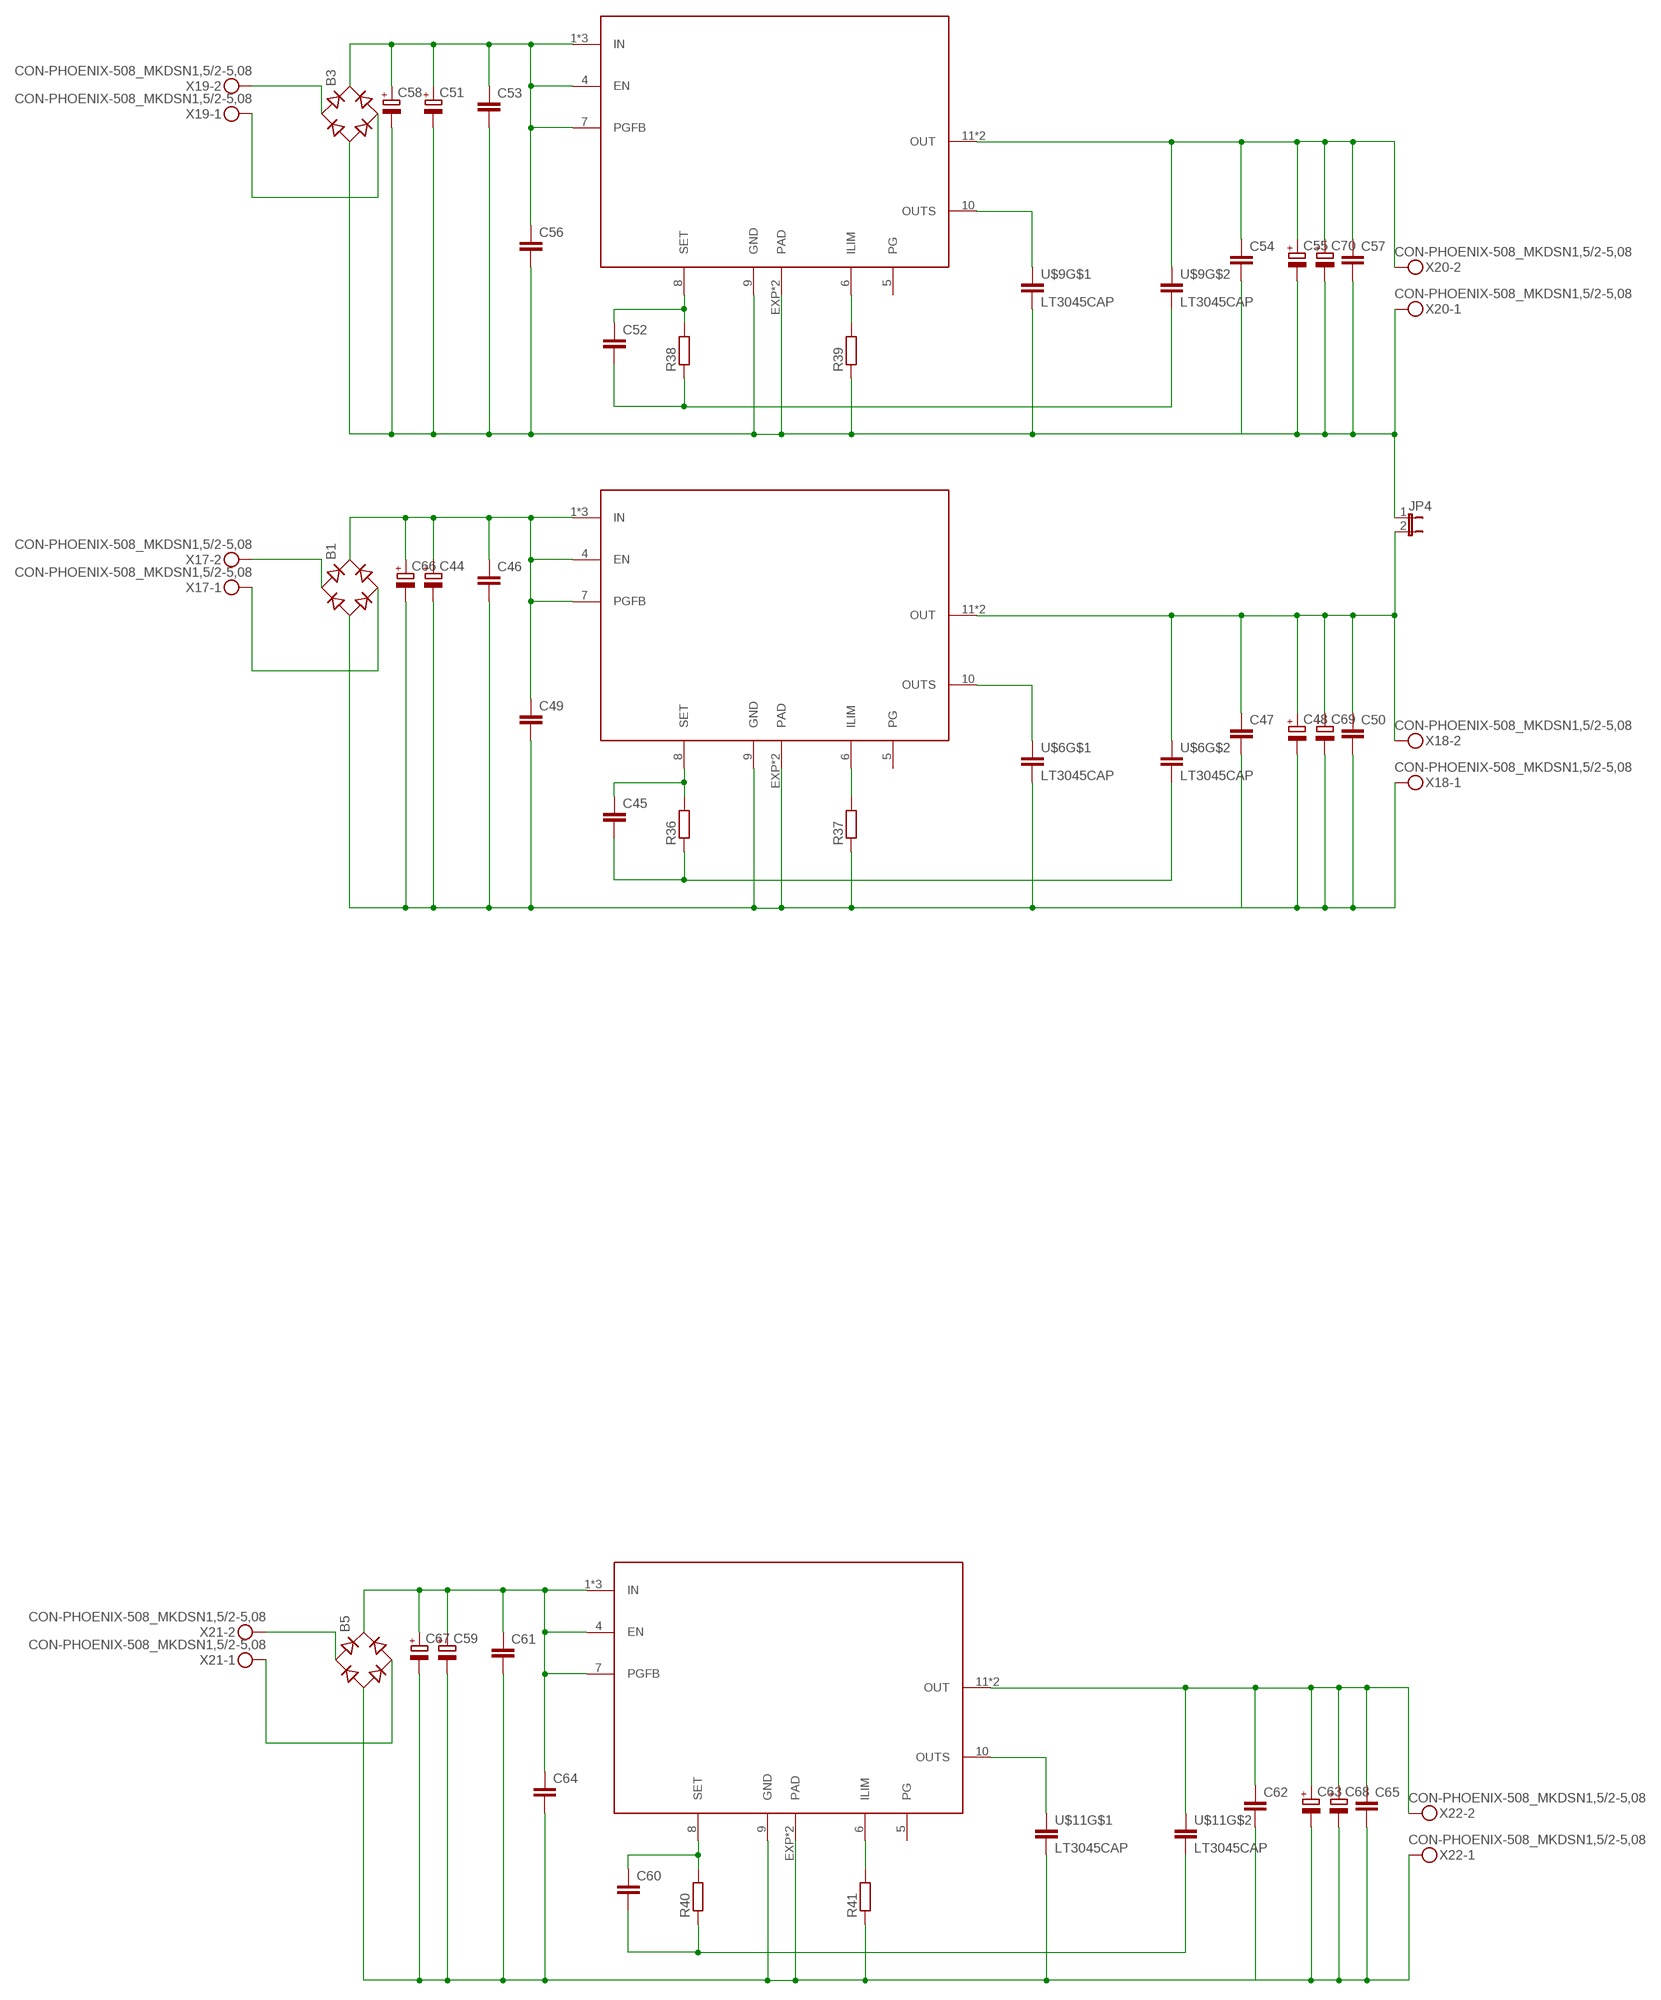
[diagram p6: schematic, sheet 7]

### Parts
B1  RB1A  [RB1A]
B3  RB1A  [RB1A]
B5  RB1A  [RB1A]
C44  CPOL-EUE7.5-18  [E7,5-18]
C45  C-EUC1206  [C1206]
C46  C-EU050-050X075  [C050-050X075]
C47  C-EU050-050X075  [C050-050X075]
C48  CPOL-EUE5-10.5  [E5-10,5]
C49  C-EUC1206  [C1206]
C50  C-EUC1206  [C1206]
C51  CPOL-EUE7.5-18  [E7,5-18]
C52  C-EUC1206  [C1206]
C53  C-EU050-050X075  [C050-050X075]
C54  C-EU050-050X075  [C050-050X075]
C55  CPOL-EUE5-10.5  [E5-10,5]
C56  C-EUC1206  [C1206]
C57  C-EUC1206  [C1206]
C58  CPOL-EUSP-CAP-CX  [SP-CAP-CX]
C59  CPOL-EUE7.5-18  [E7,5-18]
C60  C-EUC1206  [C1206]
C61  C-EU050-050X075  [C050-050X075]
C62  C-EU050-050X075  [C050-050X075]
C63  CPOL-EUE5-10.5  [E5-10,5]
C64  C-EUC1206  [C1206]
C65  C-EUC1206  [C1206]
C66  CPOL-EUSP-CAP-CX  [SP-CAP-CX]
C67  CPOL-EUSP-CAP-CX  [SP-CAP-CX]
C68  CPOL-EUSP-CAP-CX  [SP-CAP-CX]
C69  CPOL-EUSP-CAP-CX  [SP-CAP-CX]
C70  CPOL-EUSP-CAP-CX  [SP-CAP-CX]
JP4  JP1E  [JP1]
R36  R-EU_MELF0204R  [MINI_MELF-0204R]
R37  R-EU_MELF0204R  [MINI_MELF-0204R]
R38  R-EU_MELF0204R  [MINI_MELF-0204R]
R39  R-EU_MELF0204R  [MINI_MELF-0204R]
R40  R-EU_MELF0204R  [MINI_MELF-0204R]
R41  R-EU_MELF0204R  [MINI_MELF-0204R]
U$4  LT3045  [MSOP12]
U$6  LT3045CAP  [LT3045CAP]
U$8  LT3045  [MSOP12]
U$9  LT3045CAP  [LT3045CAP]
U$10  LT3045  [MSOP12]
U$11  LT3045CAP  [LT3045CAP]
X17  CON-PHOENIX-508_MKDSN1,5/2-5,08  [CON-PHOENIX-508_MKDSN1,5/2-5,08]
X18  CON-PHOENIX-508_MKDSN1,5/2-5,08  [CON-PHOENIX-508_MKDSN1,5/2-5,08]
X19  CON-PHOENIX-508_MKDSN1,5/2-5,08  [CON-PHOENIX-508_MKDSN1,5/2-5,08]
X20  CON-PHOENIX-508_MKDSN1,5/2-5,08  [CON-PHOENIX-508_MKDSN1,5/2-5,08]
X21  CON-PHOENIX-508_MKDSN1,5/2-5,08  [CON-PHOENIX-508_MKDSN1,5/2-5,08]
X22  CON-PHOENIX-508_MKDSN1,5/2-5,08  [CON-PHOENIX-508_MKDSN1,5/2-5,08]

### Nets
GND1: B1.- C44.- C46.2 C47.2 C48.- C49.2 C50.2 C66.- C69.- R37.1 U$4.9(GND) U$4.EXP1(PAD) U$4.EXP(PAD) U$6.5 X18.1
GND2: B3.- C51.- C53.2 C54.2 C55.- C56.2 C57.2 C58.- C70.- JP4.1 R39.1 U$8.9(GND) U$8.EXP1(PAD) U$8.EXP(PAD) U$9.5 X20.1
GND3: B5.- C59.- C61.2 C62.2 C63.- C64.2 C65.2 C67.- C68.- R41.1 U$10.9(GND) U$10.EXP1(PAD) U$10.EXP(PAD) U$11.5 X22.1
IN1: B1.+ C44.+ C46.1 C49.1 C66.+ U$4.1(IN) U$4.2(IN) U$4.3(IN) U$4.4(EN) U$4.7(PGFB)
IN2: B3.+ C51.+ C53.1 C56.1 C58.+ U$8.1(IN) U$8.2(IN) U$8.3(IN) U$8.4(EN) U$8.7(PGFB)
IN3: B5.+ C59.+ C61.1 C64.1 C67.+ U$10.1(IN) U$10.2(IN) U$10.3(IN) U$10.4(EN) U$10.7(PGFB)
N$59: U$4.10(OUTS) U$6.3
N$60: R37.2 U$4.6(ILIM)
N$61: B1.AC2 X17.1
N$62: B1.AC1 X17.2
N$63: U$8.10(OUTS) U$9.3
N$64: R39.2 U$8.6(ILIM)
N$65: B3.AC2 X19.1
N$66: B3.AC1 X19.2
N$67: U$10.10(OUTS) U$11.3
N$68: R41.2 U$10.6(ILIM)
N$69: B5.AC2 X21.1
N$70: B5.AC1 X21.2
OUT1: C47.1 C48.+ C50.1 C69.+ JP4.2 U$4.11(OUT) U$4.12(OUT) U$6.4 X18.2
OUT2: C54.1 C55.+ C57.1 C70.+ U$8.11(OUT) U$8.12(OUT) U$9.4 X20.2
OUT3: C62.1 C63.+ C65.1 C68.+ U$10.11(OUT) U$10.12(OUT) U$11.4 X22.2
SET1: C45.1 R36.2 U$4.8(SET)
SET2: C52.1 R38.2 U$8.8(SET)
SET3: C60.1 R40.2 U$10.8(SET)
SGND1: C45.2 R36.1 U$6.6
SGND2: C52.2 R38.1 U$9.6
SGND3: C60.2 R40.1 U$11.6
Unconnected: U$4.5(PG) U$8.5(PG) U$10.5(PG)

## Power pins joined to a net without a drawn wire
GND: J1.GND
VBUS: J1.VBUS

## Library data of the parts
B1 B3 B5 = rectifier:RB1A: RECTIFIER 1 A
C1-C3 C5-C8 C10-C15 C17 C19-C21 C23 C26 C29-C39 C45-C47 C49 C50 C52-C54 C56 C57 C60-C62 C64 C65 = Vwvwbg:C-EU: CAPACITOR, European symbol
C4 C9 C16 C18 C22 C24 C25 C27 C28 C40-C44 C48 C51 C55 C58 C59 C63 C66-C70 = Vwvwbg:CPOL-EU: POLARIZED CAPACITOR, European symbol
D1 = diode:1N4148: DIODE high speed (Philips)
D2-D9 = diode:DIODE-: DIODE
D10 D11 D13 D14 D24 = led:LED: LED OSRAM: - CHIPLED LG R971, LG N971, LY N971, LG Q971, LY Q971, LO R971, LY R971 LH N974, LH R974 LS Q976, LO Q976, LY Q976 LO Q996 - Hyper CHIPLED LW Q18S LB Q993, LB Q99A, LB R99A - SideLED LS A670, LO A670, LY A670, LG A670, LP A670 LB A673, LV A673, LT A673, LW A673 LH A674 LY A675 LS A676, LA A676, LO A676, LY A676, LW A676 LS A679, LY A679, LG A679 - Hyper Micro SIDELED® LS Y876, LA Y876, LO Y876, LY Y876 LT Y87S - SmartLED LW L88C, LW L88S LB L89C, LB L89S, LG L890 LS L89K, LO L89K, LY L89K LS L896, LA L896, LO L896, LY L896 - TOPLED LS T670, LO T670, LY T670, LG T670, LP T670 LSG T670, LSP T670, LSY T670, LOP T670, LYG T670 LG T671, LOG T671, LSG T671 LB T673, LV T673, LT T673, LW T673 LH T674 LS T676, LA T676, LO T676, LY T676, LB T676, LH T676, LSB T676, LW T676 LB T67C, LV T67C, LT T67C, LS T67K, LO T67K, LY T67K, LW E67C LS E67B, LA E67B, LO E67B, LY E67B, LB E67C, LV E67C, LT E67C LW T67C LS T679, LY T679, LG T679 LS T770, LO T770, LY T770, LG T770, LP T770 LB T773, LV T773, LT T773, LW T773 LH T774 LS E675, LA E675, LY E675, LS T675 LS T776, LA T776, LO T776, LY T776, LB T776 LHGB T686 LT T68C, LB T68C - Hyper Mini TOPLED® LB M676 - Mini TOPLED Santana® LG M470 LS M47K, LO M47K, LY M47K Source: http://www.osram.convergy.de LUXEON: - LUMILED® LXK2-PW12-R00, LXK2-PW12-S00, LXK2-PW14-U00, LXK2-PW14-V00 LXK2-PM12-R00, LXK2-PM12-S00, LXK2-PM14-U00 LXK2-PE12-Q00, LXK2-PE12-R00, LXK2-PE12-S00, LXK2-PE14-T00, LXK2-PE14-U00 LXK2-PB12-K00, LXK2-PB12-L00, LXK2-PB12-M00, LXK2-PB14-N00, LXK2-PB14-P00, LXK2-PB14-Q00 LXK2-PR12-L00, LXK2-PR12-M00, LXK2-PR14-Q00, LXK2-PR14-R00 LXK2-PD12-Q00, LXK2-PD12-R00, LXK2-PD12-S00 LXK2-PH12-R00, LXK2-PH12-S00 LXK2-PL12-P00, LXK2-PL12-Q00, LXK2-PL12-R00 Source: www.luxeon.com KINGBRIGHT: KA-3528ASYC Source: www.kingbright.com
D12 D15 = diode:1N4728: Z DIODE 3.3 V, 1W, 5 percent
D16 D17 D20-D23 = diode:1N4148-V
D18 D19 = linear-technology:LT1021-V
D25-D28 = diode:MUR810: DIODE
H1-H9 H12 H13 = holes:MOUNT-PAD-ROUND: MOUNTING PAD, round
IC1 IC2 = Vwvwbg:PGA2311
IC3 IC4 = burr-brown:OPA2131: General Purpose FET-Input Operational Amplifiers Product Folder:OPA2131; OC_FARNELL: unknown; OC_NEWARK: unknown
IC5 IC6 = burr-brown:OPA134: Operational Amplifiers SoundPlus(TM) High Performance Audio; MF: TEXAS INSTRUMENTS; MPN: OPA134PA; OC_FARNELL: 1335032; OC_NEWARK: 75C4599
IC7 IC8 = linear:LM339: Low Power Low Offset Voltage Quad Comparators with open collector; LM139/LM239/LM339/LM2901/LM3302
J1 = SparkFun-Connectors:USB_B: USB Type B Connector SparkFun Products: SparkFun Stepoko <https://www.sparkfun.com/products/13899> PTH; PROD_ID: CONN-08278; SF_ID: PRT-00139
J3 = SparkFun-Connectors:CONN_10X2: Multi connection point. Often used as Generic Header-pin footprint for 0.1 inch spaced/style header connections On any of the 0.1 inch spaced packages, you can populate with these: Break Away Headers - Straight <https://www.sparkfun.com/products/116> (PRT-00116) Break Away Male Headers - Right Angle <https://www.sparkfun.com/products/553> (PRT-00553) Female Headers <https://www.sparkfun.com/products/115> (PRT-00115) Break Away Headers - Machine Pin <https://www.sparkfun.com/products/117> (PRT-00117) Break Away Female Headers - Swiss Machine Pin <https://www.sparkfun.com/products/743> (PRT-00743) Special note about the "SPECIAL" package: This was SPECIALLY designed to be used with our Graphic LCD Backpack. Be sure you want to use this! It is not only staggered on each line of header holes, but IT IS ALSO offset of the center point of the top and bottom lines by 5 mil. This causes the headers to lock into place on the "standard" footprint on the LCD screen. The extra squares on the tdocu layer are there simply to reference other pins (if you were to actually populate a longer header than ten long - this is what we do with the backpacks).
JP1 JP5 = pinhead:PINHD-2X6: PIN HEADER
JP2 JP3 = pinhead:PINHD-2X8: PIN HEADER
JP4 = jumper:JP1E: JUMPER
K2 = relay:G5V-2: OMRON PCB Relay Source: http://www.omron.com/ecb/products/pdf/en-g5v2.pdf; MPN: G5V-2 5DC; OC_FARNELL: 9949488; OC_NEWARK: 78K5703
PCB2 = e14_Rpi3_RevA:RPI3: Device for Raspberry Pi 3 board created by Dave Young for www.element14.com More information and support community is available at https://www.element14.com/community/community/raspberry-pi
Q1 Q3 Q6 Q13 = transistor:*-PNP-: PNP Transistror
Q2 Q10\ Q11 Q14 = transistor:*-NPN-: NPN Transistror BF959 corrected 2008.03.06
Q4 = TO264:MJL4281: MJL4281 NPN BCE TO-264
Q5 = transistor:MJE15031
Q7 = TO264:MJL4302: MJL4302 PNP BCE TO-264
Q8 Q12 U$2 = tranzistory FET:2N7000
Q9 = transistor:MJE15030
R1-R41 = Vwvwbg:R-EU_: RESISTOR, European symbol
RCA1-RCA4 = Vwvwbg:RCA
U$1 = Vwvwbg:TORX147
U$3 = Vwvwbg:DYNALO_DRILL
U$4 U$8 U$10 = Vwvwbg:LT3045
U$5 = Vwvwbg:DD21
U$6 U$9 U$11 = Vwvwbg:LT3045CAP
U$7 = Vwvwbg:IRM-15-5
X1 = con-neutrik_ag:NC3: Neutrik Audio Connector XLR SERIES Stereo 1/4" jack Source: www.neutrik.com/; MPN: NC3FAH-2-0; OC_FARNELL: unknown; OC_NEWARK: 11J5829
X2 X3 = con-neutrik_ag:NC3: Neutrik Audio Connector XLR SERIES Stereo 1/4" jack Source: www.neutrik.com/; MPN: NC3MBH-B; OC_FARNELL: unknown; OC_NEWARK: 27B4288
X4 X8 X9 X13 = con-phoenix-508:MKDSN1,5/3-5,08: MKDSN 1,5/ 3-5,08 Printklemme Nennstrom: 13,5 A Nennspannung: 250 V Rastermaß: 5,08 mm Polzahl: 3 Anschlussart: Schraubanschluss Montage: Löten Anschlussrichtung Leiter/Platine: 0 ° Artikelnummer: 1729131 Source: http://eshop.phoenixcontact.com .. 1729131.pdf
X5 = con-phoenix-508:MKDSN1,5/5-5,08: MKDSN 1,5/ 5-5,08 Printklemme Nennstrom: 13,5 A Nennspannung: 250 V Rastermaß: 5,08 mm Polzahl: 5 Anschlussart: Schraubanschluss Montage: Löten Anschlussrichtung Leiter/Platine: 0 ° Artikelnummer: 1729157 Source: http://eshop.phoenixcontact.com .. 1729157.pdf
X6 X7 = Vwvwbg:MKDSN1,5/5-5,08: MKDSN 1,5/ 5-5,08 Printklemme Nennstrom: 13,5 A Nennspannung: 250 V Rastermaß: 5,08 mm Polzahl: 5 Anschlussart: Schraubanschluss Montage: Löten Anschlussrichtung Leiter/Platine: 0 ° Artikelnummer: 1729157 Source: http://eshop.phoenixcontact.com .. 1729157.pdf
X10 X11 = Vwvwbg:CON-PHOENIX-508_MKDSN1,5/3-5,08: MKDSN 1,5/ 3-5,08 Printklemme Nennstrom: 13,5 A Nennspannung: 250 V Rastermaß: 5,08 mm Polzahl: 3 Anschlussart: Schraubanschluss Montage: Löten Anschlussrichtung Leiter/Platine: 0 ° Artikelnummer: 1729131 Source: http://eshop.phoenixcontact.com .. 1729131.pdf
X12 X17-X22 = Vwvwbg:CON-PHOENIX-508_MKDSN1,5/2-5,08: MKDSN 1,5/ 2-5,08 Printklemme Nennstrom: 13,5 A Nennspannung: 250 V Rastermaß: 5,08 mm Polzahl: 2 Anschlussart: Schraubanschluss Montage: Löten Anschlussrichtung Leiter/Platine: 0 ° Artikelnummer: 1729128 Source: http://eshop.phoenixcontact.com .. 1729128.pdf
X14-X16 = con-phoenix-508:MKDSN1,5/2-5,08: MKDSN 1,5/ 2-5,08 Printklemme Nennstrom: 13,5 A Nennspannung: 250 V Rastermaß: 5,08 mm Polzahl: 2 Anschlussart: Schraubanschluss Montage: Löten Anschlussrichtung Leiter/Platine: 0 ° Artikelnummer: 1729128 Source: http://eshop.phoenixcontact.com .. 1729128.pdf